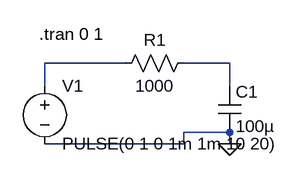
[diagram p0: schematic Draft1.asc]
Draft1.asc, the LTspice schematic file:
Version 4.1
SHEET 1 880 680
WIRE 144 96 32 96
WIRE 288 96 224 96
WIRE 32 128 32 96
WIRE 288 128 288 96
WIRE 288 192 224 192
WIRE 224 208 224 192
WIRE 224 208 32 208
WIRE 288 208 288 192
FLAG 288 208 0
SYMBOL voltage 32 112 R0
WINDOW 123 0 0 Left 0
WINDOW 39 0 0 Left 0
SYMATTR InstName V1
SYMATTR Value PULSE(0 1 0 1m 1m 10 20)
SYMBOL res 240 80 R90
WINDOW 0 0 56 VBottom 2
WINDOW 3 32 56 VTop 2
SYMATTR InstName R1
SYMATTR Value 1000
SYMBOL cap 272 128 R0
SYMATTR InstName C1
SYMATTR Value 100µ
TEXT 24 56 Left 2 !.tran 0 1

The netlist it stands for:
* Draft1.asc
V1 N001 0 PULSE(0 1 0 1m 1m 10 20)
R1 N002 N001 1000
C1 N002 0 100µ
.tran 0 1
.backanno
.end